# Altium schematic sheet TOP.SchDoc
size A4; Organization: Altium Limited; Address1: L3, 12a Rodborough Rd; Address2: Frenchs Forest; Address3: NSW; Address4: Australia 2086
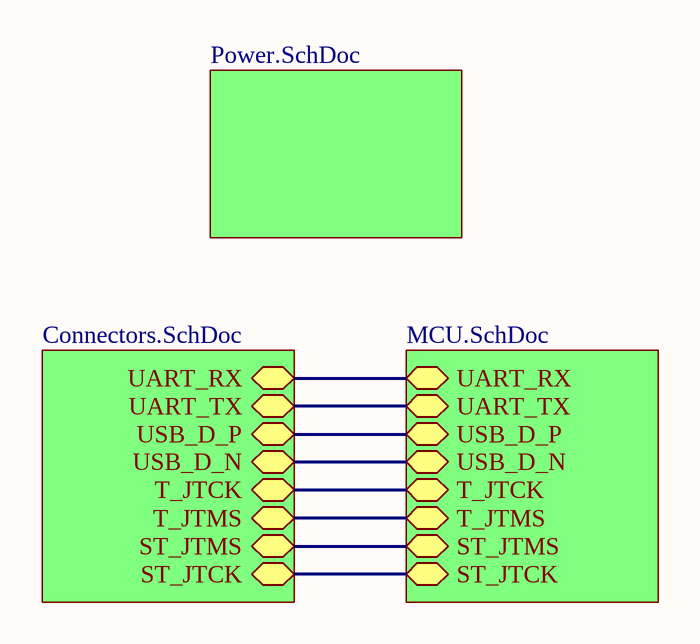
[diagram p0: TOP.SchDoc]

## Sub-sheets
CONNECTORS = Connectors.SchDoc: UART_RX (bidir), UART_TX (bidir), USB_D_P (bidir), USB_D_N (bidir), T_JTCK (bidir), T_JTMS (bidir), ST_JTMS (bidir), ST_JTCK (bidir)
MCU = MCU.SchDoc: UART_RX (bidir), UART_TX (bidir), USB_D_P (bidir), USB_D_N (bidir), T_JTCK (bidir), T_JTMS (bidir), ST_JTMS (bidir), ST_JTCK (bidir)
POWER = Power.SchDoc: no entries

## Nets
(unnamed): sheet MCU/UART_RX, sheet CONNECTORS/UART_RX
(unnamed): sheet MCU/UART_TX, sheet CONNECTORS/UART_TX
(unnamed): sheet MCU/USB_D_P, sheet CONNECTORS/USB_D_P
(unnamed): sheet MCU/USB_D_N, sheet CONNECTORS/USB_D_N
(unnamed): sheet MCU/T_JTCK, sheet CONNECTORS/T_JTCK
(unnamed): sheet MCU/T_JTMS, sheet CONNECTORS/T_JTMS
(unnamed): sheet MCU/ST_JTMS, sheet CONNECTORS/ST_JTMS
(unnamed): sheet MCU/ST_JTCK, sheet CONNECTORS/ST_JTCK

## Notes on the sheet
- Title
- Size:
- Date:
- A4
- Number:
- Time:
- Revision:
- Sheet
- of
- File: